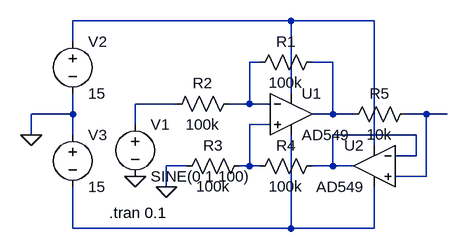
[diagram p0: schematic VoltagetoCurrent.asc]
VoltagetoCurrent.asc, the LTspice schematic file:
Version 4
SHEET 1 880 680
WIRE 192 -16 -144 -16
WIRE 320 -16 192 -16
WIRE -144 16 -144 -16
WIRE 144 48 128 48
WIRE 256 48 224 48
WIRE 192 96 192 -16
WIRE 16 112 -48 112
WIRE 128 112 128 48
WIRE 128 112 96 112
WIRE 160 112 128 112
WIRE -144 128 -144 96
WIRE -144 128 -208 128
WIRE 256 128 256 48
WIRE 256 128 224 128
WIRE 288 128 256 128
WIRE 400 128 368 128
WIRE 432 128 400 128
WIRE -48 144 -48 112
WIRE 160 144 128 144
WIRE -208 160 -208 128
WIRE -144 160 -144 128
WIRE 384 160 256 160
WIRE 320 176 320 -16
WIRE 384 192 384 160
WIRE 384 192 352 192
WIRE 32 208 0 208
WIRE 128 208 128 144
WIRE 128 208 112 208
WIRE 144 208 128 208
WIRE 256 208 256 160
WIRE 256 208 224 208
WIRE 288 208 256 208
WIRE 400 224 400 128
WIRE 400 224 352 224
WIRE 0 240 0 208
WIRE -144 304 -144 240
WIRE 192 304 192 160
WIRE 192 304 -144 304
WIRE 320 304 320 240
WIRE 320 304 192 304
FLAG 0 240 0
FLAG -48 224 0
FLAG -208 160 0
SYMBOL Opamps\\AD549 192 64 R0
SYMATTR InstName U1
SYMBOL voltage -144 0 R0
WINDOW 123 0 0 Left 0
WINDOW 39 0 0 Left 0
SYMATTR InstName V2
SYMATTR Value 15
SYMBOL voltage -144 144 R0
WINDOW 123 0 0 Left 0
WINDOW 39 0 0 Left 0
SYMATTR InstName V3
SYMATTR Value 15
SYMBOL res 240 32 R90
WINDOW 0 0 56 VBottom 2
WINDOW 3 32 56 VTop 2
SYMATTR InstName R1
SYMATTR Value 100k
SYMBOL res 112 96 R90
WINDOW 0 0 56 VBottom 2
WINDOW 3 32 56 VTop 2
SYMATTR InstName R2
SYMATTR Value 100k
SYMBOL res 128 192 R90
WINDOW 0 0 56 VBottom 2
WINDOW 3 32 56 VTop 2
SYMATTR InstName R3
SYMATTR Value 100k
SYMBOL res 240 192 R90
WINDOW 0 0 56 VBottom 2
WINDOW 3 32 56 VTop 2
SYMATTR InstName R4
SYMATTR Value 100k
SYMBOL Opamps\\AD549 320 144 M0
SYMATTR InstName U2
SYMBOL res 384 112 R90
WINDOW 0 0 56 VBottom 2
WINDOW 3 32 56 VTop 2
SYMATTR InstName R5
SYMATTR Value 10k
SYMBOL voltage -48 128 R0
WINDOW 123 0 0 Left 0
WINDOW 39 0 0 Left 0
SYMATTR InstName V1
SYMATTR Value SINE(0 1 100)
TEXT -88 280 Left 2 !.tran 0.1

The netlist it stands for:
* VoltagetoCurrent.asc
XU1 N006 N002 N001 N008 N003 AD549  ; pins In+ In- V+ V- OUT
V2 N001 0 15
V3 0 N008 15
R1 N003 N002 100k
R2 N002 N004 100k
R3 N006 0 100k
R4 N007 N006 100k
XU2 N005 N007 N001 N008 N007 AD549  ; pins In+ In- V+ V- OUT
R5 N005 N003 10k
V1 N004 0 SINE(0 1 100)
.tran 0.1
.backanno
.end